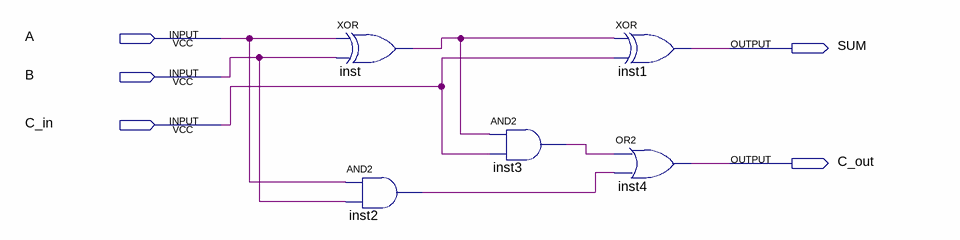
[diagram p0: schematic sheet]
// Quartus schematic 1-bit_adder.bdf as structural Verilog: 5 symbols, 5 pins
module \1-bit_adder  (
  input  A,
  input  B,
  input  C_in,
  output SUM,
  output C_out
);

  wire inst2_out, inst3_out, inst_out;

  xor inst (inst_out, A, B);
  and inst2 (inst2_out, A, B);
  and inst3 (inst3_out, inst_out, C_in);
  xor inst1 (SUM, inst_out, C_in);
  or inst4 (C_out, inst3_out, inst2_out);
endmodule
